# Altium schematic sheet OVERVIEW.SchDoc
size A3; DocumentNumber: 3; SheetNumber: 3; SheetTotal: 19
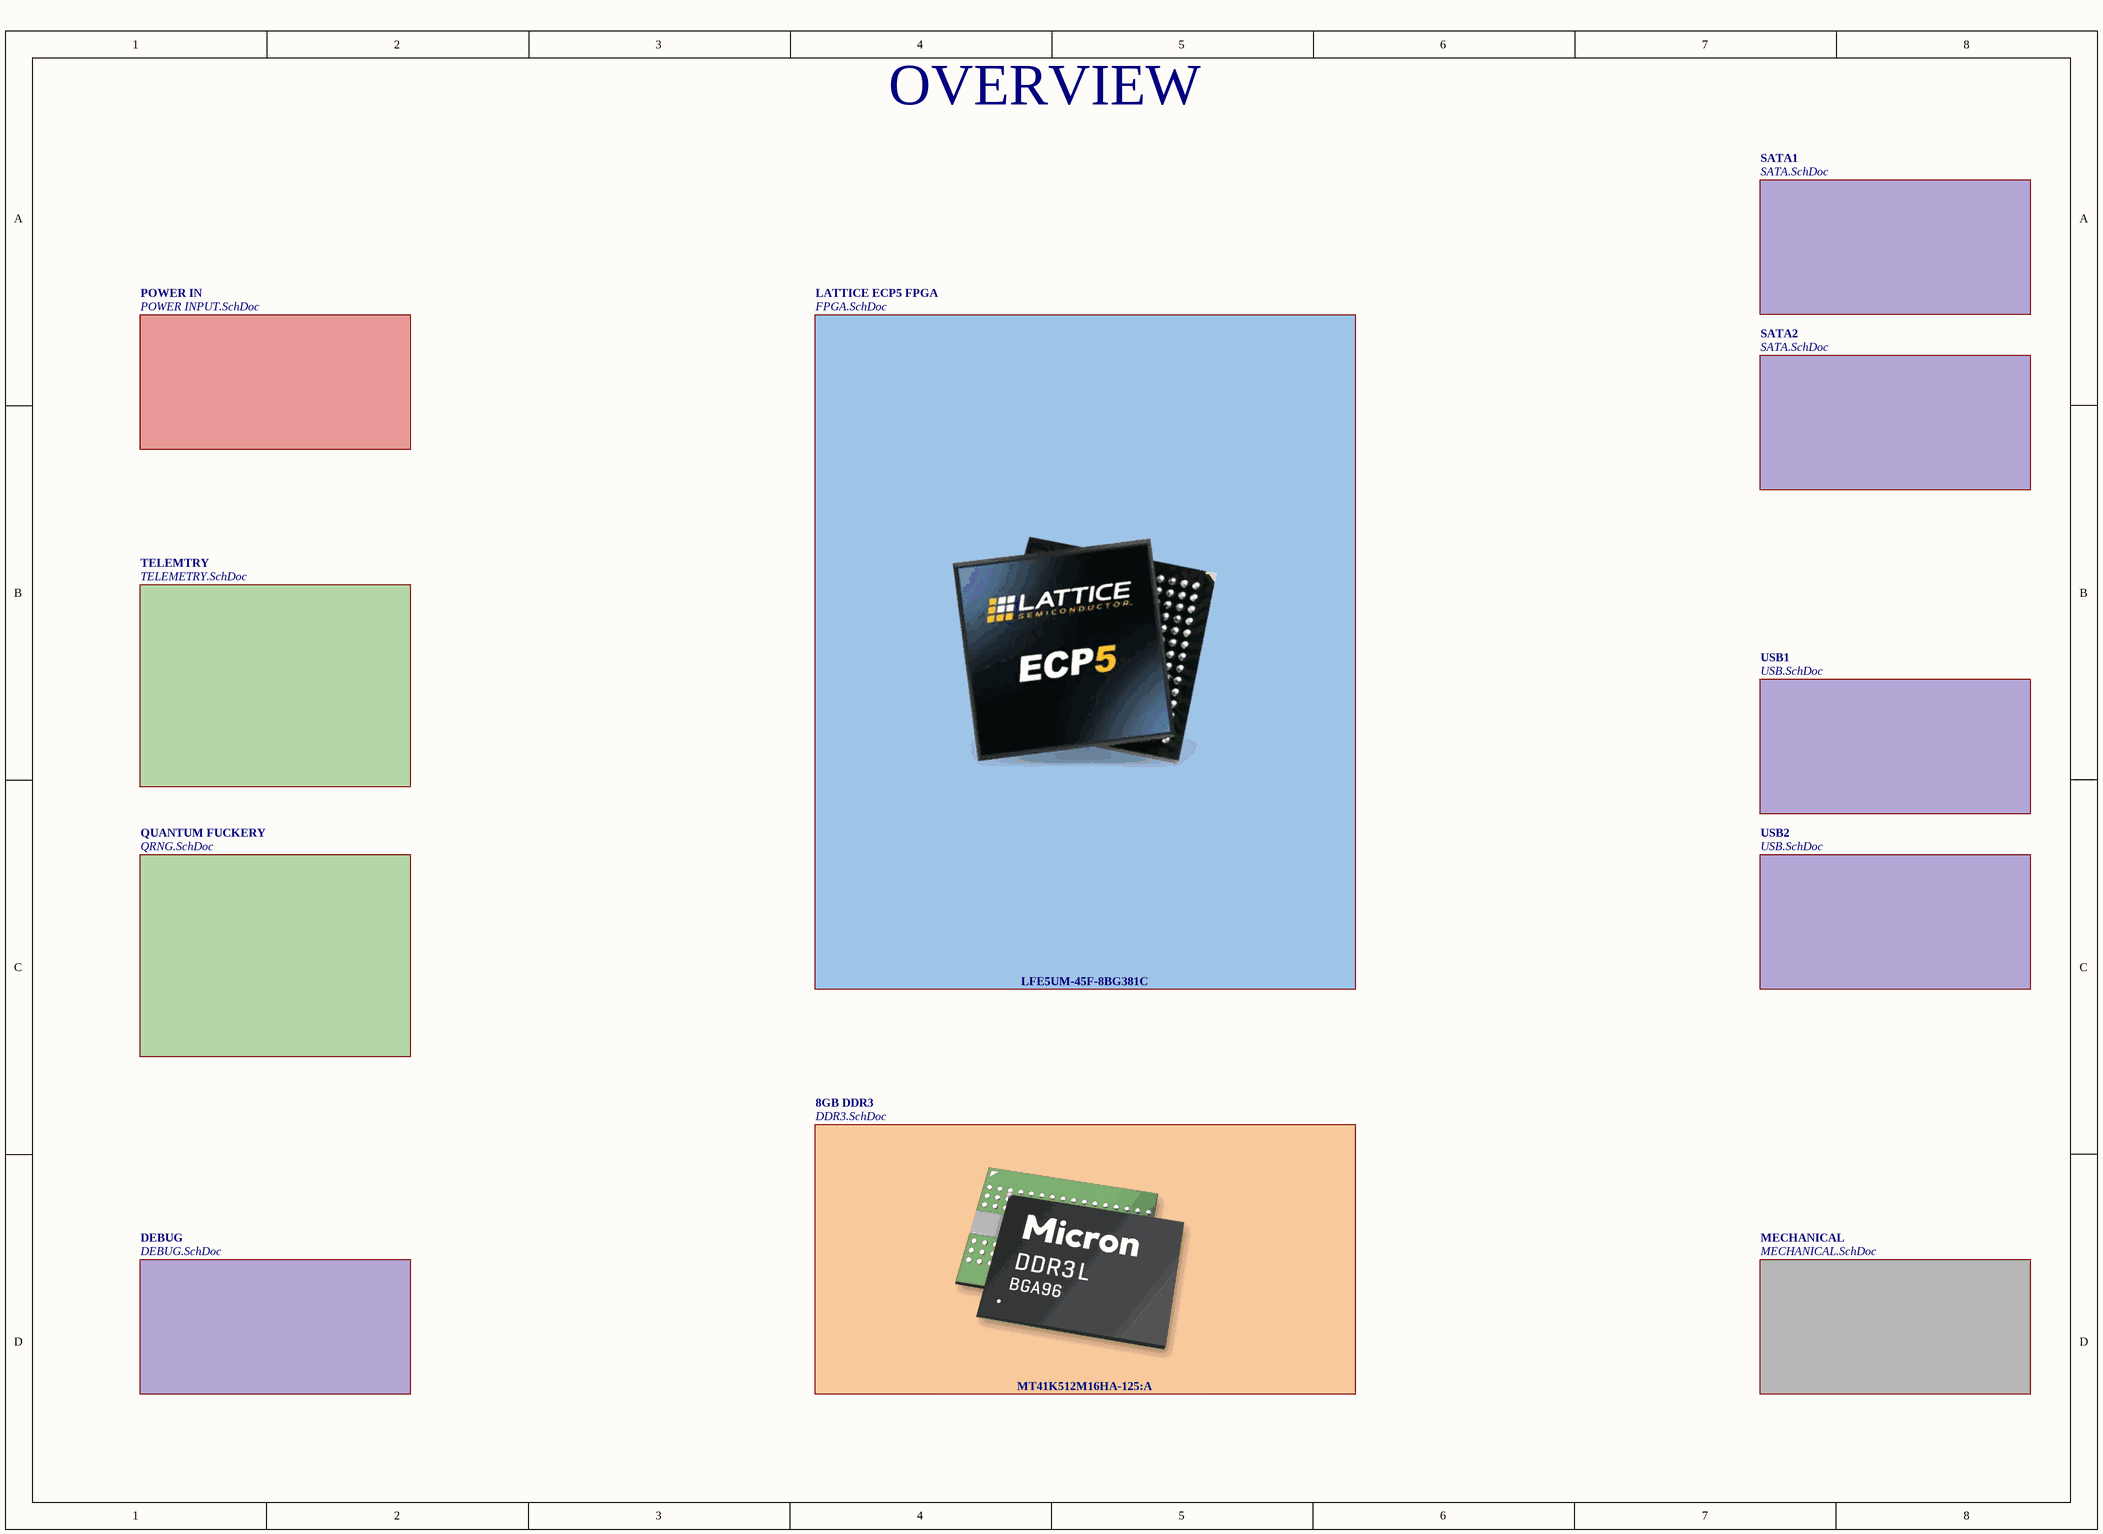
[diagram p0: OVERVIEW.SchDoc]

## Sub-sheets
8GB DDR3 = DDR3.SchDoc: no entries
DEBUG = DEBUG.SchDoc: no entries
LATTICE ECP5 FPGA = FPGA.SchDoc: no entries
MECHANICAL = MECHANICAL.SchDoc: no entries
POWER IN = POWER INPUT.SchDoc: no entries
QUANTUM FUCKERY = QRNG.SchDoc: no entries
SATA1 = SATA.SchDoc: no entries
SATA2 = SATA.SchDoc: no entries
TELEMTRY = TELEMETRY.SchDoc: no entries
USB1 = USB.SchDoc: no entries
USB2 = USB.SchDoc: no entries

## Notes on the sheet
- OVERVIEW
- LFE5UM-45F-8BG381C
- MT41K512M16HA-125:A